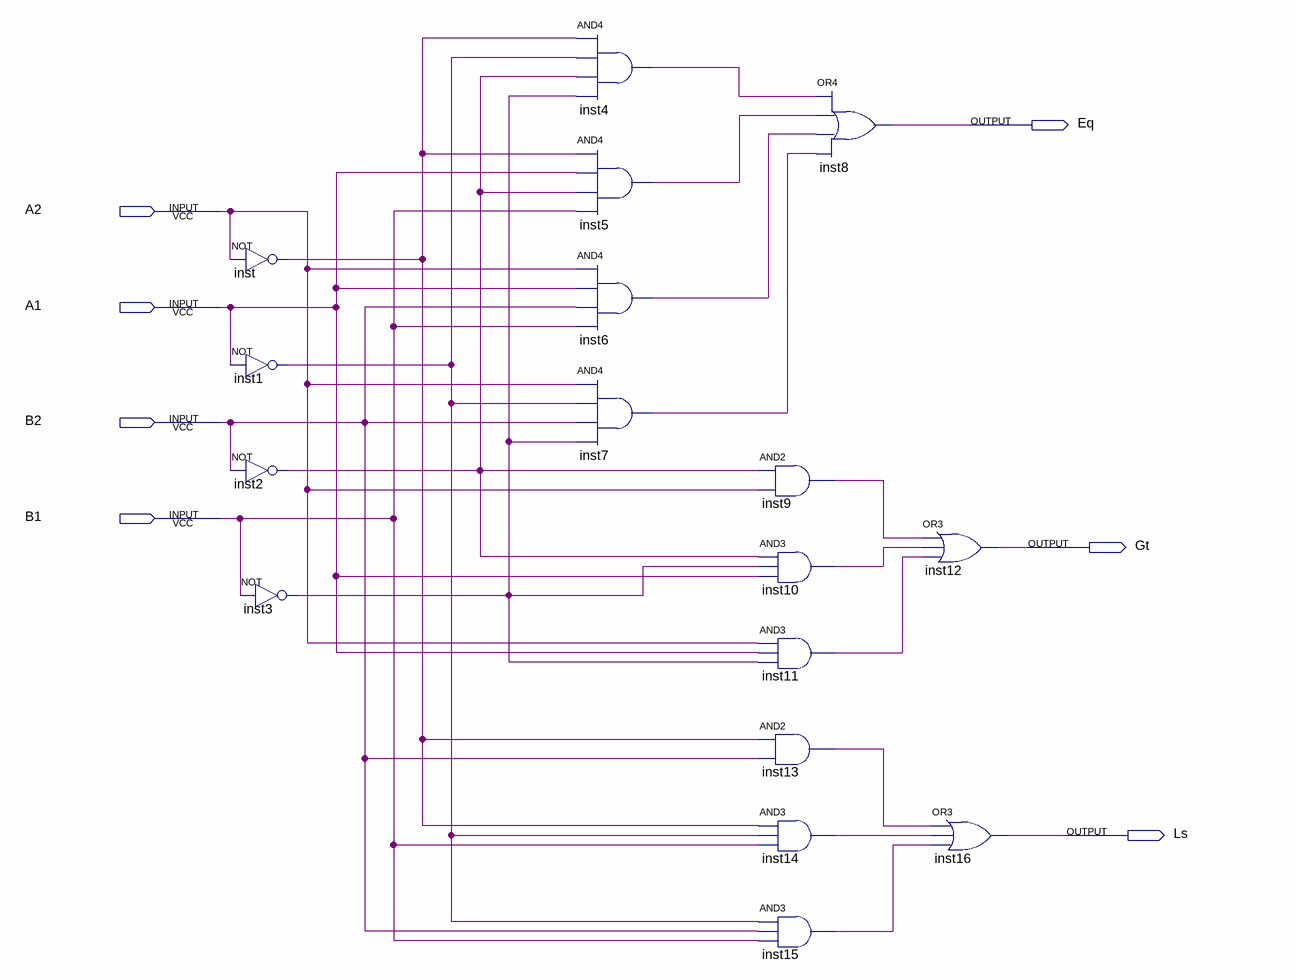
[diagram p0: schematic sheet]
// Quartus schematic two_bits_compare.bdf as structural Verilog: 17 symbols, 7 pins
module two_bits_compare (
  input  A2,
  input  A1,
  input  B2,
  input  B1,
  output Eq,
  output Gt,
  output Ls
);

  wire inst1_out, inst2_out, inst3_out, inst4_out, inst5_out, inst6_out, inst7_out, inst9_out, inst10_out,
       inst11_out, inst13_out, inst14_out, inst15_out, inst_out;

  not inst (inst_out, A2);
  not inst1 (inst1_out, A1);
  not inst2 (inst2_out, B2);
  not inst3 (inst3_out, B1);
  and inst4 (inst4_out, inst_out, inst1_out, inst2_out, inst3_out);
  and inst5 (inst5_out, inst_out, A1, inst2_out, B1);
  and inst6 (inst6_out, A2, A1, B2, B1);
  and inst7 (inst7_out, A2, inst1_out, B2, inst3_out);
  and inst9 (inst9_out, inst2_out, A2);
  and inst10 (inst10_out, inst2_out, inst3_out, A1);
  and inst11 (inst11_out, A2, A1, inst3_out);
  and inst13 (inst13_out, inst_out, B2);
  and inst14 (inst14_out, inst_out, inst1_out, B1);
  and inst15 (inst15_out, inst1_out, B2, B1);
  or inst8 (Eq, inst4_out, inst5_out, inst6_out, inst7_out);
  or inst12 (Gt, inst9_out, inst10_out, inst11_out);
  or inst16 (Ls, inst13_out, inst14_out, inst15_out);
endmodule
